# Altium schematic sheet Supply.SchDoc
size A4
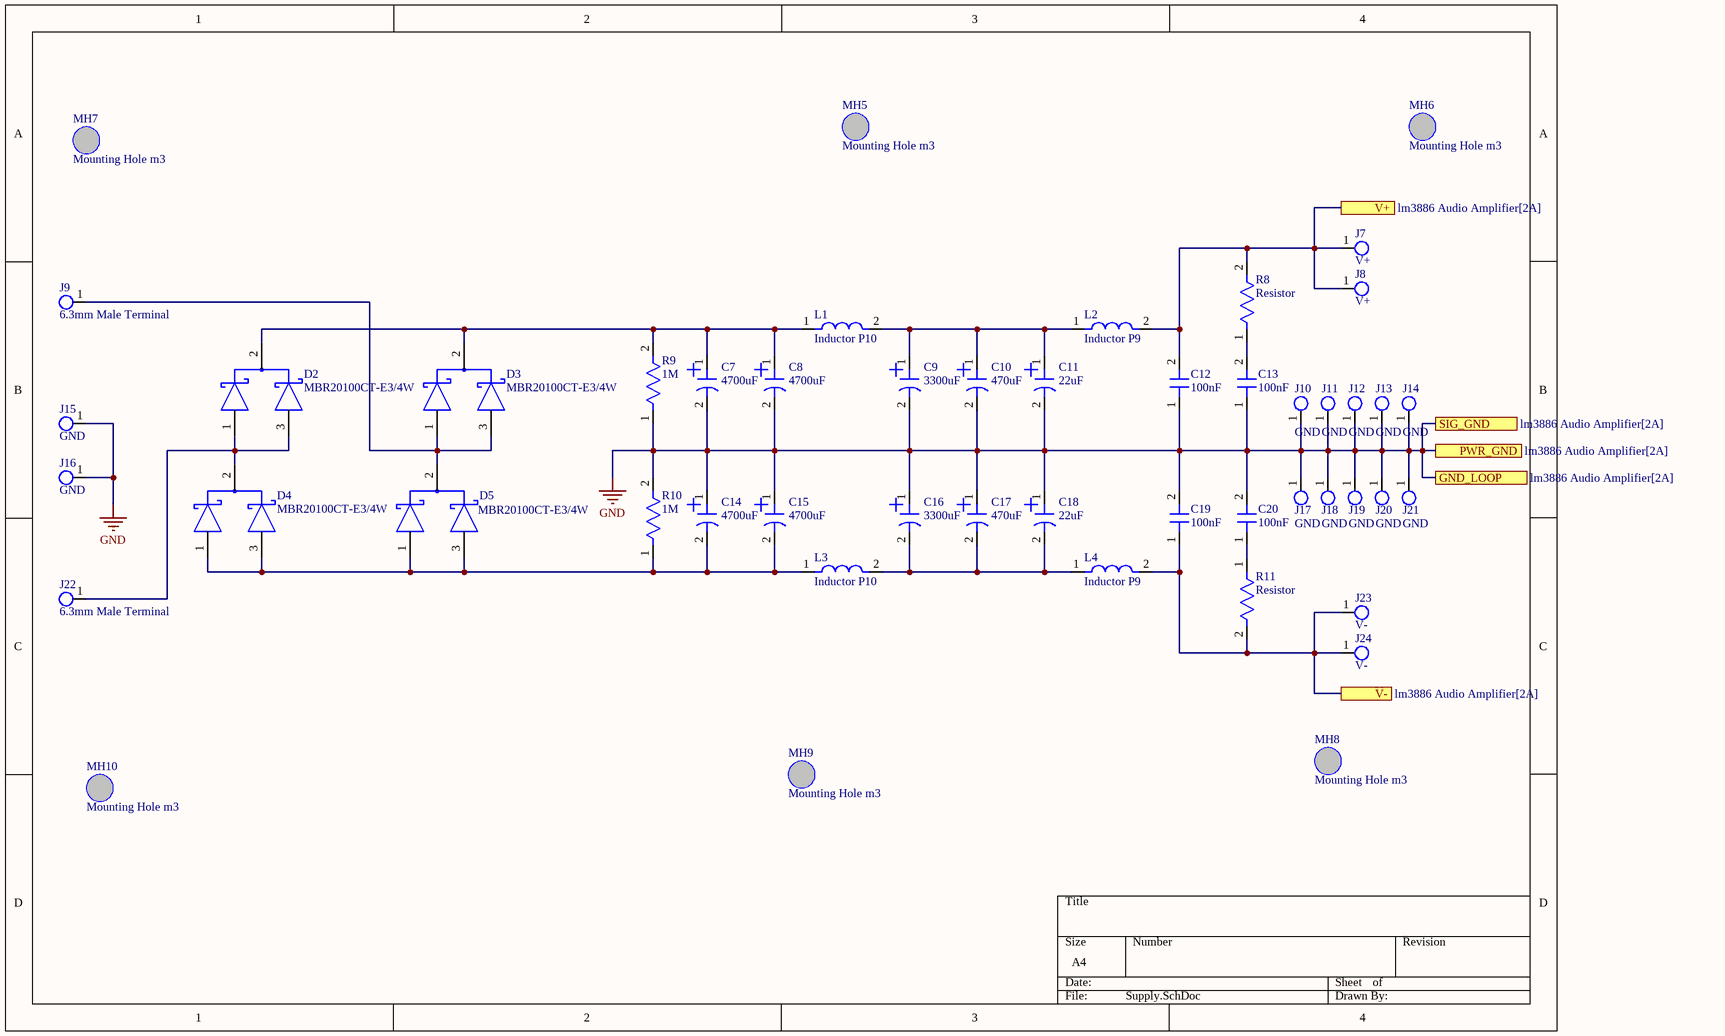
[diagram p0: Supply.SchDoc]

## Parts
C7  4700uF  [Capacitor electrolytic 25x41mm]
C8  4700uF  [Capacitor electrolytic 25x41mm]
C9  3300uF  [Capacitor electrolytic 16x21mm]
C10  470uF  [Capacitor electrolytic 10x16mm]
C11  22uF  [Capacitor electrolytic 5x11mm]
C12  100nF  [Capacitor P5 3x7.5mm]
C13  100nF  [Capacitor P5 5x7.5mm]
C14  4700uF  [Capacitor electrolytic 25x41mm]
C15  4700uF  [Capacitor electrolytic 25x41mm]
C16  3300uF  [Capacitor electrolytic 16x21mm]
C17  470uF  [Capacitor electrolytic 10x16mm]
C18  22uF  [Capacitor electrolytic 5x11mm]
C19  100nF  [Capacitor P5 3x7.5mm]
C20  100nF  [Capacitor P5 5x7.5mm]
D2  MBR20100CT-E3/4W  [FP-MBR20100CT-E3-4W-MFG]
D3  MBR20100CT-E3/4W  [FP-MBR20100CT-E3-4W-MFG]
D4  MBR20100CT-E3/4W  [FP-MBR20100CT-E3-4W-MFG]
D5  MBR20100CT-E3/4W  [FP-MBR20100CT-E3-4W-MFG]
J7  V+  [Terminal 6.3mm male]
J8  V+  [Terminal 6.3mm male]
J9  6.3mm Male Terminal  [Terminal 6.3mm male]
J10  GND  [Terminal 6.3mm male]
J11  GND  [Terminal 6.3mm male]
J12  GND  [Terminal 6.3mm male]
J13  GND  [Terminal 6.3mm male]
J14  GND  [Terminal 6.3mm male]
J15  GND  [Terminal 6.3mm male]
J16  GND  [Terminal 6.3mm male]
J17  GND  [Terminal 6.3mm male]
J18  GND  [Terminal 6.3mm male]
J19  GND  [Terminal 6.3mm male]
J20  GND  [Terminal 6.3mm male]
J21  GND  [Terminal 6.3mm male]
J22  6.3mm Male Terminal  [Terminal 6.3mm male]
J23  V-  [Terminal 6.3mm male]
J24  V-  [Terminal 6.3mm male]
L1  Inductor P10  [Inductor p10]
L2  Inductor P9  [Inductor p10]
L3  Inductor P10  [Inductor p10]
L4  Inductor P9  [Inductor p10]
MH5  Mounting Hole m3  [Mounting Hole]
MH6  Mounting Hole m3  [Mounting Hole]
MH7  Mounting Hole m3  [Mounting Hole]
MH8  Mounting Hole m3  [Mounting Hole]
MH9  Mounting Hole m3  [Mounting Hole]
MH10  Mounting Hole m3  [Mounting Hole]
R8  Resistor  [Resistor 0617 2W Vertical]
R9  1M  [Resistor 0207 1/4W]
R10  1M  [Resistor 0207 1/4W]
R11  Resistor  [Resistor 0617 2W Vertical]

## Ports
GND_LOOP (see lm3886 Audio Amplifier[2A]), PWR_GND (see lm3886 Audio Amplifier[2A]), SIG_GND (see lm3886 Audio Amplifier[2A]), V+ (see lm3886 Audio Amplifier[2A]), V- (see lm3886 Audio Amplifier[2A])

## Nets
GND: C7.2 C8.2 C9.2 C10.2 C11.2 C12.1 C13.1 C14.1 C15.1 C16.1 C17.1 C18.1 C19.2 C20.2 J10.1 J11.1 J12.1 J13.1 J14.1 J15.1 J16.1 J17.1 J18.1 J19.1 J20.1 J21.1 R9.1 R10.2 ; port PWR_GND, port SIG_GND, port GND_LOOP
V+: C12.2 J7.1 J8.1 L2.2 R8.2 ; port V+
V-: C19.1 J23.1 J24.1 L4.2 R11.2 ; port V-
NetC7_1: C7.1 C8.1 D2.2(COMMON_CATHODE) D3.2(COMMON_CATHODE) L1.1 R9.2
NetC9_1: C9.1 C10.1 C11.1 L1.2 L2.1
NetC13_2: C13.2 R8.1
NetC14_2: C14.2 C15.2 D4.1(1_ANODE) D4.3(2_ANODE) D5.1(1_ANODE) D5.3(2_ANODE) L3.1 R10.1
NetC16_2: C16.2 C17.2 C18.2 L3.2 L4.1
NetC20_1: C20.1 R11.1
NetD2_1: D2.1(1_ANODE) D2.3(2_ANODE) D4.2(COMMON_CATHODE) J22.1
NetD3_1: D3.1(1_ANODE) D3.3(2_ANODE) D5.2(COMMON_CATHODE) J9.1

## Library data of the parts
C7-C11 C14-C18 = Capacitor Polar
C12 C13 C19 C20 = Capacitor
D2-D5 = CMP-00030-42878425-1: MBR20100CT-E3/4W Dual Common-Cathode High-Voltage Schottky Rectifier; Forward Voltage: 800mV; Max Junction Temperature (Tj): 150°C; Forward Current: 20A; Max Reverse Voltage (DC): 100V; Max Surge Current: 150A; Max Reverse Leakage Current: 100µA; Average Rectified Current: 10A; Element Configuration: Common Cathode; Length: 10.5156mm; Schedule B: 8541100080, 8541100080; Case/Package: TO-220AB; NexarPartId: 42878425; Number of Pins: 3; Min Operating Temperature: -65°C; Reverse Voltage: 100V; Height: 15.3162mm; Peak Non-Repetitive Surge Current: 150A; RoHS: Compliant; Max Operating Temperature: 150°C; Radiation Hardening: No; Lead Free: Lead Free; Mount: Through Hole; Max Repetitive Reverse Voltage (Vrrm): 100V; Max Forward Surge Current (Ifsm): 150A; Width: 4.699mm; Peak Reverse Current: 100µA
J7 J8 J10-J21 J23 J24 = 6.3mm Male Terminal
L1-L4 = Inductor
R9 R10 = Resistor